# EAGLE design BUZZI-34 (EAGLE 4.15)
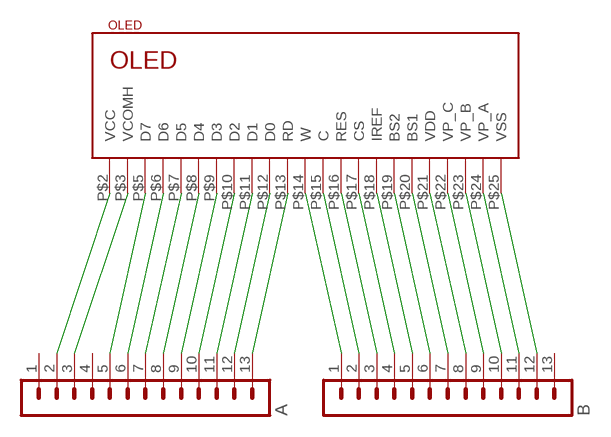
[diagram p0: schematic, sheet 1]

## Parts
A  MA13-1  [MA13-1]
B  MA13-1  [MA13-1]
OLED  OS096064PH10FC1A10  [PICTIVA_OS096064PH10FC1A10]

## Nets
N$1: A.2 OLED.P$2(VCC)
N$2: A.3 OLED.P$3(VCOMH)
N$3: A.5 OLED.P$5(D7)
N$4: A.6 OLED.P$6(D6)
N$5: A.7 OLED.P$7(D5)
N$6: A.8 OLED.P$8(D4)
N$7: A.9 OLED.P$9(D3)
N$8: A.10 OLED.P$10(D2)
N$9: A.11 OLED.P$11(D1)
N$10: A.12 OLED.P$12(D0)
N$12: B.1 OLED.P$14(W)
N$13: B.2 OLED.P$15(C)
N$14: B.3 OLED.P$16(RES)
N$15: B.4 OLED.P$17(CS)
N$16: B.5 OLED.P$18(IREF)
N$17: B.6 OLED.P$19(BS2)
N$18: B.7 OLED.P$20(BS1)
N$19: B.8 OLED.P$21(VDD)
N$20: B.9 OLED.P$22(VP_C)
N$21: B.10 OLED.P$23(VP_B)
N$22: B.11 OLED.P$24(VP_A)
N$23: B.12 OLED.P$25(VSS)
OLED: A.13 OLED.P$13(RD)
Unconnected: A.1 A.4 B.13

## Library data of the parts
A B = turbod3:MA13-1: PIN HEADER
OLED = turbod3:OS096064PH10FC1A10

## Board
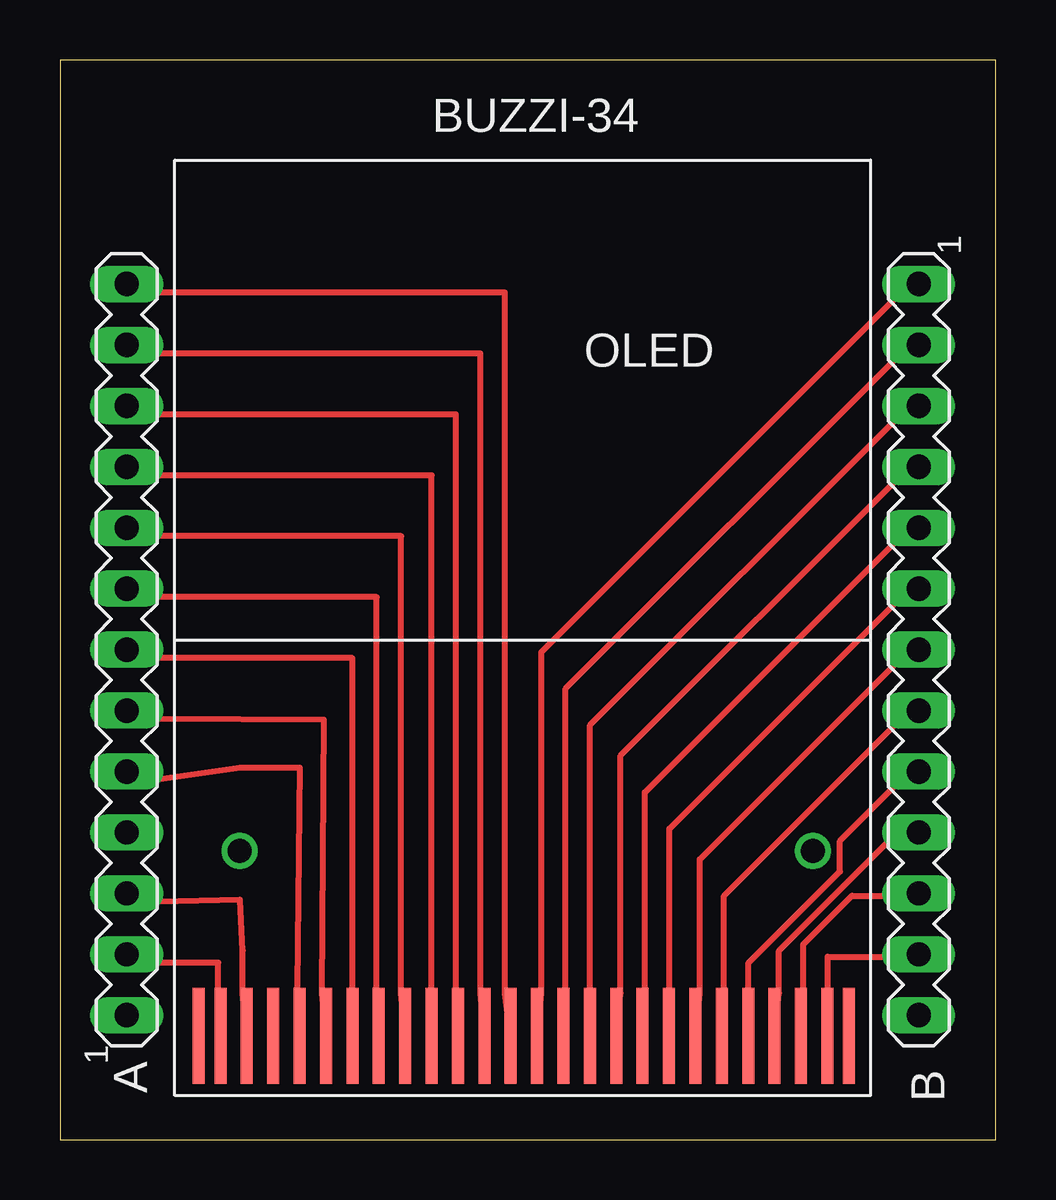
[diagram p1: board, top side]

Size 39 x 45 mm. Coordinates in mm from the lower left corner, seen from the top.
Outline: 0,0 39,0 39,45 0,45 0,0
Copper layers (1*16): Top 0.035mm / dielectric 1.5mm / Bottom 0.035mm
Design rules "default": minimum track width 10mil, minimum drill 24mil, track to track 8mil, track to pad 8mil, pad to pad 8mil, via to via 8mil, smd to smd 8mil, copper to edge 40mil, drill to drill 8mil, minimum pad ring 10mil, minimum via ring 8mil, stop-mask expansion 4mil, vias tented up to drill 0mil, thermal gap 10mil

### Footprints (pad centres in the part's own frame; a part is rotated, then mirrored left to right if it is on the bottom)
MA13-1 = drill 1.016 long: 1 -15.24,0; 2 -12.7,0; 3 -10.16,0; 4 -7.62,0; 5 -5.08,0; 6 -2.54,0; 7 0,0; 8 2.54,0; 9 5.08,0; 10 7.62,0; 11 10.16,0; 12 12.7,0; 13 15.24,0
PICTIVA_OS096064PH10FC1A10 = smd 0.5 x 4: P$1 -13,5.5; P$2 -12.1,5.5; P$3 -11,5.5; P$4 -9.9,5.5; P$5 -8.8,5.5; P$6 -7.7,5.5; P$7 -6.6,5.5; P$8 -5.5,5.5; P$9 -4.4,5.5; P$10 -3.3,5.5; P$11 -2.2,5.5; P$12 -1.1,5.5; P$13 0,5.5; P$14 1.1,5.5; P$15 2.2,5.5; P$16 3.3,5.5; P$17 4.4,5.5; P$18 5.5,5.5; P$19 6.6,5.5; P$20 7.7,5.5; P$21 8.8,5.5; P$22 9.9,5.5; P$23 11,5.5; P$24 12.1,5.5; P$25 13.2,5.5; P$26 14.1,5.5 | drill 1 round: P$27 -11.3,13.2; P$28 12.6,13.2

### Placement (x,y rotation side)
A  2.78,20.42 90 top
B  35.8,20.42 270 top
OLED  18.79,-1.17 0 top

### Tracks (layer width: path | path; a pad name or v marks a point on that pad's centre or on a via)
N$1
  Top 0.254: A.2 4.06,7.37 6.6,7.37 6.6,6.1 OLED.P$2
N$2
  Top 0.254: A.3 4.06,9.91 7.5,10 7.62,7.87 7.62,6.1 OLED.P$3
N$3
  Top 0.254: A.5 4,15 7.5,15.5 10,15.5 9.91,6.35 9.91,6.1 OLED.P$5
N$4
  Top 0.254: A.6 4.06,17.53 11,17.5 10.92,6.1 OLED.P$6
N$5
  Top 0.254: A.7 4.06,20.07 12.19,20.07 12.19,6.1 OLED.P$7
N$6
  Top 0.254: A.8 4.06,22.61 13.21,22.61 13.21,6.1 OLED.P$8
N$7
  Top 0.254: A.9 4.06,25.15 14.22,25.15 14.22,6.1 OLED.P$9
N$8
  Top 0.254: A.10 4.06,27.69 15.49,27.69 15.49,6.1 OLED.P$10
N$9
  Top 0.254: A.11 4.06,30.23 16.51,30.23 16.51,6.1 OLED.P$11
N$10
  Top 0.254: A.12 4.06,32.77 17.53,32.77 17.53,6.1 OLED.P$12
N$12
  Top 0.254: B.1 34.8,35.05 20.07,20.32 20.07,6.1 OLED.P$14
N$13
  Top 0.254: B.2 34.8,32.51 21.08,18.8 21.08,6.1 OLED.P$15
N$14
  Top 0.254: B.3 34.8,29.97 22.1,17.27 22.1,6.1 OLED.P$16
N$15
  Top 0.254: B.4 34.8,27.43 23.37,16 23.37,6.1 OLED.P$17
N$16
  Top 0.254: B.5 34.8,24.89 24.38,14.48 24.38,6.1 OLED.P$18
N$17
  Top 0.254: B.6 34.8,22.35 25.4,12.95 25.4,6.1 OLED.P$19
N$18
  Top 0.254: B.7 34.8,19.81 26.67,11.68 26.67,6.1 OLED.P$20
N$19
  Top 0.254: B.8 34.8,17.27 27.69,10.16 27.69,6.1 OLED.P$21
N$20
  Top 0.254: B.9 34.8,14.73 32.51,12.45 32.51,11.18 28.7,7.37 28.7,6.1 OLED.P$22
N$21
  Top 0.254: B.10 34.54,12.45 29.97,7.87 29.97,6.1 OLED.P$23
N$22
  Top 0.254: B.11 34.29,10.16 33.02,10.16 30.99,8.13 30.99,6.1 OLED.P$24
N$23
  Top 0.254: B.12 34.29,7.62 32,7.62 32,6.1 OLED.P$25
OLED
  Top 0.254: A.13 4.06,35.31 18.54,35.31 18.54,6.1 OLED.P$13

### Text on the board
tPlace: BUZZI-34